# EAGLE schematic ApuR1 (EAGLE 6.5.0)
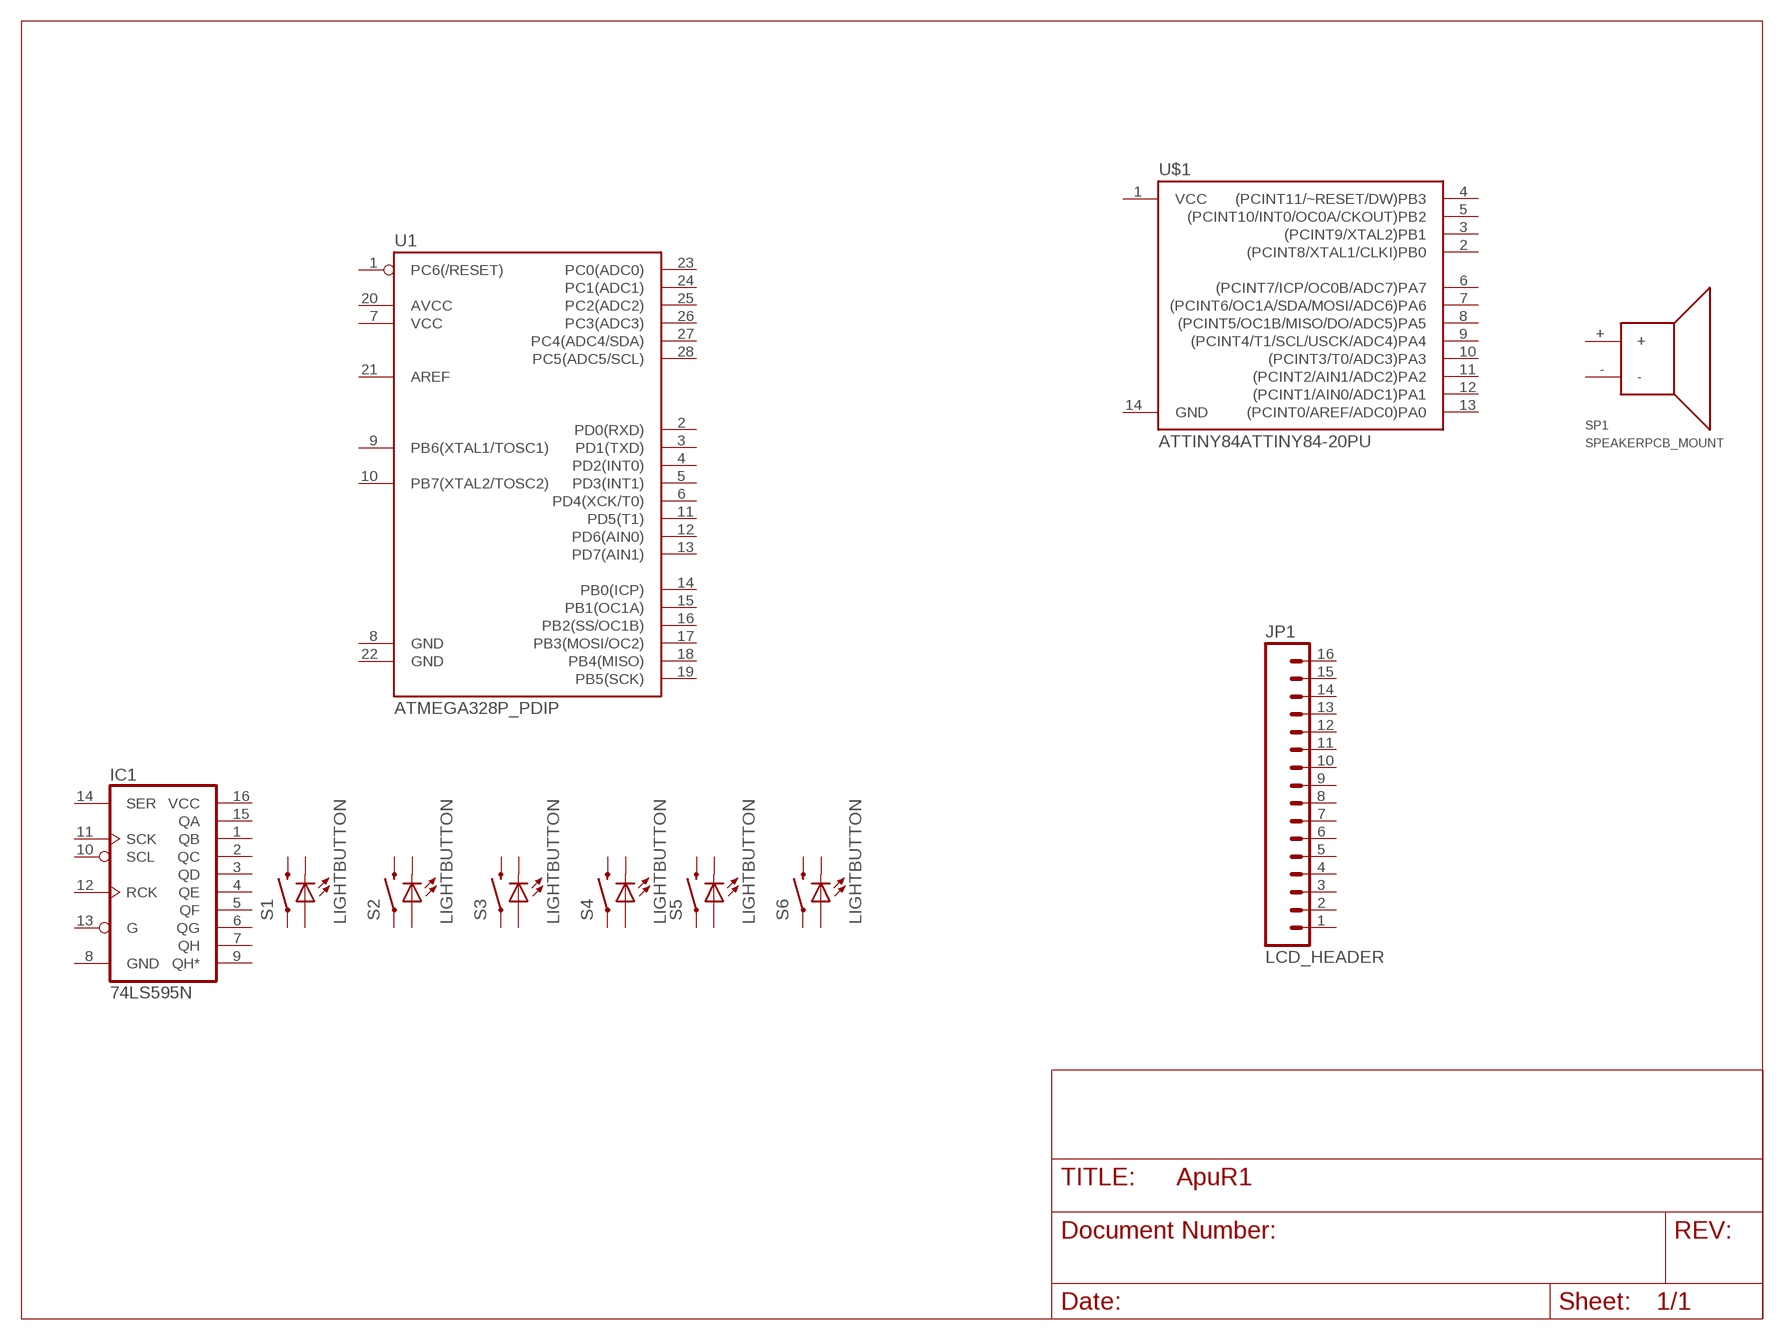
[diagram p0: schematic, sheet 1]

## Parts
IC1  74LS595N  [DIL16]
JP1  LCD_HEADER  M16PTH  [1X16]
S1  LIGHTBUTTON  SWITCH-MOMENTARY-LEDPTH  [TACTILE-PTH-LED-12MM]
S2  LIGHTBUTTON  SWITCH-MOMENTARY-LEDPTH  [TACTILE-PTH-LED-12MM]
S3  LIGHTBUTTON  SWITCH-MOMENTARY-LEDPTH  [TACTILE-PTH-LED-12MM]
S4  LIGHTBUTTON  SWITCH-MOMENTARY-LEDPTH  [TACTILE-PTH-LED-12MM]
S5  LIGHTBUTTON  SWITCH-MOMENTARY-LEDPTH  [TACTILE-PTH-LED-12MM]
S6  LIGHTBUTTON  SWITCH-MOMENTARY-LEDPTH  [TACTILE-PTH-LED-12MM]
SP1  SPEAKERPCB_MOUNT  [PCB_MOUNT_SPEAKER]
U1  ATMEGA328P_PDIP  [DIL28-3]
U$1  ATTINY84ATTINY84-20PU  [DIL14]
Unconnected: IC1.1(QB) IC1.2(QC) IC1.3(QD) IC1.4(QE) IC1.5(QF) IC1.6(QG) IC1.7(QH) IC1.9(QH*) IC1.10(SCL) IC1.11(SCK) IC1.12(RCK) IC1.13(G) IC1.14(SER) IC1.15(QA) JP1.1 JP1.2 JP1.3 JP1.4 JP1.5 JP1.6 JP1.7 JP1.8 JP1.9 JP1.10 JP1.11 JP1.12 JP1.13 JP1.14 JP1.15 JP1.16 S1.2 S1.4 S1.A S1.C S2.2 S2.4 S2.A S2.C S3.2 S3.4 S3.A S3.C S4.2 S4.4 S4.A S4.C S5.2 S5.4 S5.A S5.C S6.2 S6.4 S6.A S6.C SP1.+ SP1.- U1.1(PC6(/RESET)) U1.2(PD0(RXD)) U1.3(PD1(TXD)) U1.4(PD2(INT0)) U1.5(PD3(INT1)) U1.6(PD4(XCK/T0)) U1.7(VCC) U1.8(GND) U1.9(PB6(XTAL1/TOSC1)) U1.10(PB7(XTAL2/TOSC2)) U1.11(PD5(T1)) U1.12(PD6(AIN0)) U1.13(PD7(AIN1)) U1.14(PB0(ICP)) U1.15(PB1(OC1A)) U1.16(PB2(SS/OC1B)) U1.17(PB3(MOSI/OC2)) U1.18(PB4(MISO)) U1.19(PB5(SCK)) U1.20(AVCC) U1.21(AREF) U1.22(GND) U1.23(PC0(ADC0)) U1.24(PC1(ADC1)) U1.25(PC2(ADC2)) U1.26(PC3(ADC3)) U1.27(PC4(ADC4/SDA)) U1.28(PC5(ADC5/SCL)) U$1.1(VCC) U$1.2((PCINT8/XTAL1/CLKI)PB0) U$1.3((PCINT9/XTAL2)PB1) U$1.4((PCINT11/~RESET/DW)PB3) U$1.5((PCINT10/INT0/OC0A/CKOUT)PB2) U$1.6((PCINT7/ICP/OC0B/ADC7)PA7) U$1.7((PCINT6/OC1A/SDA/MOSI/ADC6)PA6) U$1.8((PCINT5/OC1B/MISO/DO/ADC5)PA5) U$1.9((PCINT4/T1/SCL/USCK/ADC4)PA4) U$1.10((PCINT3/T0/ADC3)PA3) U$1.11((PCINT2/AIN1/ADC2)PA2) U$1.12((PCINT1/AIN0/ADC1)PA1) U$1.13((PCINT0/AREF/ADC0)PA0) U$1.14(GND)

## Power pins joined to a net without a drawn wire
GND: IC1.8(GND)
VCC: IC1.16(VCC)

## Library data of the parts
IC1 = SparkFun-DigitalIC:74*595: 8-bit SHIFT REGISTER, output latch
JP1 = SparkFun-Connectors:M16: 1x16 .1" header
S1-S6 = SparkFun-Electromechanical:SWITCH-MOMENTARY-LED: EZ is for Kits. There is no tStop (covering up the top side of the pads with mask). This helps the beginner see which side they should be soldering too.
SP1 = SparkFun-Electromechanical:SPEAKER: General speakers.; MFG: SANCO; PROD_#: NA; SKU: COM-11089; SPARKLE_ID: 6504
U1 = SparkFun-DigitalIC:ATMEGA328P_PDIP: uC used in the Arduino 32kb flash, 1k EEPROM, 2k SRAM This is the through-hole version of this chip.
U$1 = SparkFun-DigitalIC:ATTINY84: Atmel 14-pin 2/4/8kB flash uC